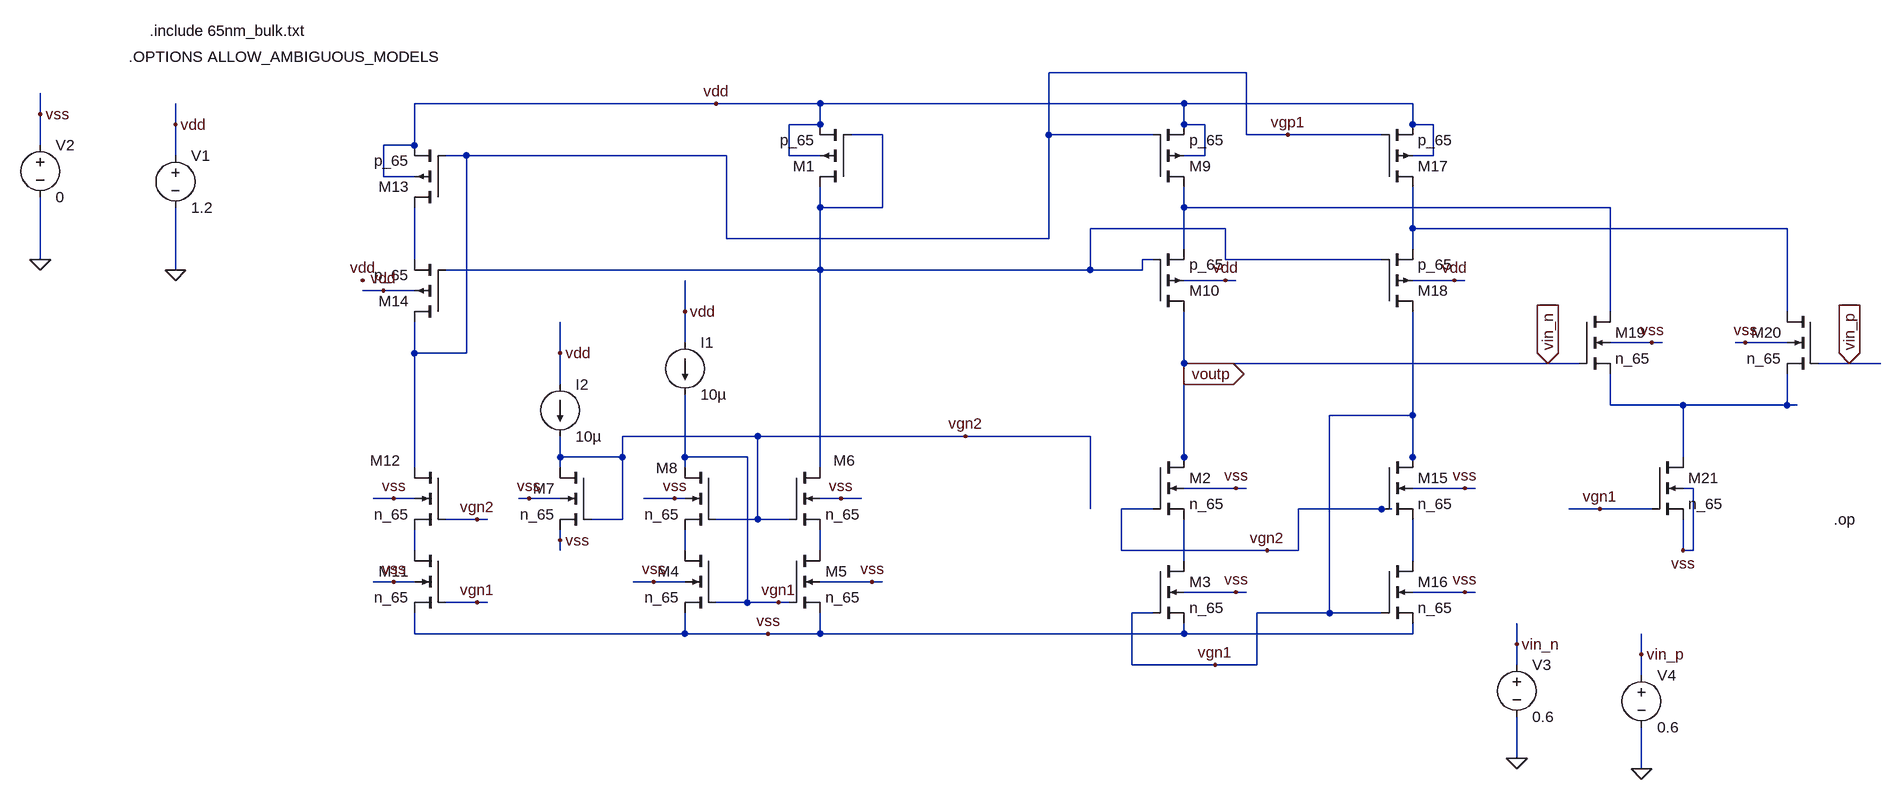
[diagram p0: schematic FC_SingleEnded_Test.asc]
FC_SingleEnded_Test.asc, the LTspice schematic file:
Version 4.1
SHEET 1 1996 680
WIRE 976 -480 672 -480
WIRE 160 -432 -304 -432
WIRE 320 -432 160 -432
WIRE 880 -432 320 -432
WIRE 1232 -432 880 -432
WIRE -880 -416 -880 -448
WIRE -672 -400 -672 -432
WIRE 320 -400 320 -432
WIRE 320 -400 272 -400
WIRE 880 -400 880 -432
WIRE 912 -400 880 -400
WIRE 1232 -400 1232 -432
WIRE 1264 -400 1232 -400
WIRE 416 -384 368 -384
WIRE 672 -384 672 -480
WIRE 832 -384 672 -384
WIRE 976 -384 976 -480
WIRE 1040 -384 976 -384
WIRE 1184 -384 1040 -384
WIRE -880 -368 -880 -416
WIRE -304 -368 -304 -432
WIRE -304 -368 -352 -368
WIRE -672 -352 -672 -400
WIRE -304 -352 -304 -368
WIRE -224 -352 -256 -352
WIRE 176 -352 -224 -352
WIRE 272 -352 272 -400
WIRE 320 -352 272 -352
WIRE 912 -352 912 -400
WIRE 912 -352 880 -352
WIRE 1264 -352 1264 -400
WIRE 1264 -352 1232 -352
WIRE -352 -320 -352 -368
WIRE -304 -320 -352 -320
WIRE 320 -272 320 -304
WIRE 416 -272 416 -384
WIRE 416 -272 320 -272
WIRE 880 -272 880 -304
WIRE 1536 -272 880 -272
WIRE 944 -240 736 -240
WIRE 1232 -240 1232 -304
WIRE 1808 -240 1232 -240
WIRE 176 -224 176 -352
WIRE 672 -224 672 -384
WIRE 672 -224 176 -224
WIRE 880 -208 880 -272
WIRE 1232 -208 1232 -240
WIRE -880 -192 -880 -288
WIRE -304 -192 -304 -272
WIRE 832 -192 816 -192
WIRE 944 -192 944 -240
WIRE 1184 -192 944 -192
WIRE -672 -176 -672 -272
WIRE 320 -176 320 -272
WIRE 320 -176 -256 -176
WIRE 736 -176 736 -240
WIRE 736 -176 320 -176
WIRE 816 -176 816 -192
WIRE 816 -176 736 -176
WIRE 944 -160 880 -160
WIRE 960 -160 944 -160
WIRE 1296 -160 1232 -160
WIRE 1312 -160 1296 -160
WIRE -352 -144 -384 -144
WIRE -304 -144 -352 -144
WIRE 112 -112 112 -160
WIRE 1536 -112 1536 -272
WIRE 1808 -112 1808 -240
WIRE 112 -64 112 -112
WIRE 1600 -64 1536 -64
WIRE 1616 -64 1600 -64
WIRE 1744 -64 1728 -64
WIRE 1808 -64 1744 -64
WIRE -304 -48 -304 -96
WIRE -224 -48 -224 -352
WIRE -224 -48 -304 -48
WIRE -80 -48 -80 -96
WIRE 880 -32 880 -112
WIRE 1440 -32 880 -32
WIRE 1488 -32 1440 -32
WIRE 1904 -32 1856 -32
WIRE 1952 -32 1904 -32
WIRE 880 -16 880 -32
WIRE -80 0 -80 -48
WIRE 1536 32 1536 -16
WIRE 1648 32 1536 32
WIRE 1808 32 1808 -16
WIRE 1808 32 1648 32
WIRE 1824 32 1808 32
WIRE 1232 48 1232 -112
WIRE 1232 48 1104 48
WIRE 224 80 16 80
WIRE 544 80 224 80
WIRE 736 80 544 80
WIRE -80 112 -80 80
WIRE 16 112 16 80
WIRE 16 112 -80 112
WIRE 112 112 112 16
WIRE 208 112 112 112
WIRE 880 112 880 -16
WIRE 1232 112 1232 48
WIRE 1648 112 1648 32
WIRE -304 128 -304 -48
WIRE -80 128 -80 112
WIRE 112 128 112 112
WIRE 320 128 320 -176
WIRE 880 128 880 112
WIRE 1232 128 1232 112
WIRE 960 160 880 160
WIRE 976 160 960 160
WIRE 1312 160 1232 160
WIRE 1328 160 1312 160
WIRE 1664 160 1648 160
WIRE -336 176 -368 176
WIRE -304 176 -336 176
WIRE -128 176 -144 176
WIRE -80 176 -128 176
WIRE 96 176 48 176
WIRE 112 176 96 176
WIRE 352 176 320 176
WIRE 384 176 352 176
WIRE 736 192 736 80
WIRE 832 192 784 192
WIRE 1184 192 1056 192
WIRE 1200 192 1184 192
WIRE 1520 192 1472 192
WIRE 1600 192 1520 192
WIRE -208 208 -256 208
WIRE -192 208 -208 208
WIRE 16 208 16 112
WIRE 16 208 -32 208
WIRE 224 208 224 80
WIRE 224 208 160 208
WIRE 272 208 224 208
WIRE -80 240 -80 224
WIRE -304 256 -304 224
WIRE -80 256 -80 240
WIRE 112 256 112 224
WIRE 320 256 320 224
WIRE 784 256 784 192
WIRE 1008 256 784 256
WIRE 1056 256 1056 192
WIRE 1056 256 1008 256
WIRE 1648 256 1648 208
WIRE 1664 256 1664 160
WIRE 1664 256 1648 256
WIRE 880 272 880 208
WIRE 1232 272 1232 208
WIRE -336 304 -368 304
WIRE -304 304 -336 304
WIRE 64 304 32 304
WIRE 112 304 64 304
WIRE 400 304 320 304
WIRE 416 304 400 304
WIRE 960 320 880 320
WIRE 976 320 960 320
WIRE 1312 320 1232 320
WIRE 1328 320 1312 320
WIRE -208 336 -256 336
WIRE -192 336 -208 336
WIRE 208 336 208 112
WIRE 208 336 160 336
WIRE 256 336 208 336
WIRE 272 336 256 336
WIRE 832 352 800 352
WIRE 1104 352 1104 48
WIRE 1104 352 992 352
WIRE 1184 352 1104 352
WIRE -304 384 -304 352
WIRE 112 384 112 352
WIRE 112 384 -304 384
WIRE 240 384 112 384
WIRE 320 384 320 352
WIRE 320 384 240 384
WIRE 880 384 880 368
WIRE 880 384 320 384
WIRE 1232 384 1232 368
WIRE 1232 384 880 384
WIRE 1392 400 1392 368
WIRE 1584 416 1584 384
WIRE 800 432 800 352
WIRE 928 432 800 432
WIRE 992 432 992 352
WIRE 992 432 928 432
WIRE 1392 432 1392 400
WIRE 1584 448 1584 416
WIRE 1392 576 1392 512
WIRE 1584 592 1584 528
FLAG 112 -112 vdd
FLAG 960 160 vss
FLAG 960 320 vss
FLAG 352 176 vss
FLAG 240 384 vss
FLAG -80 -48 vdd
FLAG -80 240 vss
FLAG 96 176 vss
FLAG 944 -160 vdd
FLAG -336 176 vss
FLAG -208 336 vgn1
FLAG -208 208 vgn2
FLAG 160 -432 vdd
FLAG -672 -176 0
FLAG -672 -400 vdd
FLAG -880 -192 0
FLAG -880 -416 vss
FLAG 880 -16 voutp
IOPIN 880 -16 Out
FLAG 1312 160 vss
FLAG 1312 320 vss
FLAG 1296 -160 vdd
FLAG 1600 -64 vss
FLAG 1744 -64 vss
FLAG 1648 256 vss
FLAG 1904 -32 vin_p
IOPIN 1904 -32 In
FLAG 1440 -32 vin_n
IOPIN 1440 -32 In
FLAG 1040 -384 vgp1
FLAG 544 80 vgn2
FLAG 928 432 vgn1
FLAG 1008 256 vgn2
FLAG 256 336 vgn1
FLAG -384 -160 vdd
FLAG -352 -144 vdd
FLAG 400 304 vss
FLAG 64 304 vss
FLAG -128 176 vss
FLAG -336 304 vss
FLAG 1392 576 0
FLAG 1392 400 vin_n
FLAG 1584 592 0
FLAG 1584 416 vin_p
FLAG 1520 192 vgn1
DATAFLAG 656 80 ""
DATAFLAG 736 -176 ""
DATAFLAG 992 -400 ""
DATAFLAG 1232 -416 ""
DATAFLAG 880 -64 ""
DATAFLAG 1232 -64 ""
DATAFLAG 1648 -240 ""
DATAFLAG 960 -272 ""
DATAFLAG 1232 256 ""
DATAFLAG 880 256 ""
DATAFLAG 1648 240 ""
DATAFLAG 848 352 ""
DATAFLAG 1088 -192 ""
DATAFLAG 1072 336 ""
DATAFLAG -240 208 ""
DATAFLAG -240 336 ""
DATAFLAG 176 208 ""
DATAFLAG 176 336 ""
DATAFLAG 64 -352 ""
DATAFLAG 16 -176 ""
DATAFLAG -304 -256 ""
DATAFLAG 1536 -224 ""
DATAFLAG 1648 80 ""
DATAFLAG 1520 176 ""
DATAFLAG 1232 -64 ""
DATAFLAG 880 48 ""
DATAFLAG 1888 -32 ""
DATAFLAG 1504 176 ""
SYMBOL pmos4 368 -304 R180
SYMATTR InstName M1
SYMATTR Value p_65
SYMATTR Value2 l=200n w=2.5u
SYMBOL nmos4 832 112 R0
SYMATTR InstName M2
SYMATTR Value n_65
SYMATTR Value2 l=200n w=10u
SYMBOL nmos4 832 272 R0
SYMATTR InstName M3
SYMATTR Value n_65
SYMATTR Value2 l=200n w=10u
SYMBOL nmos4 160 256 M0
SYMATTR InstName M4
SYMATTR Value n_65
SYMATTR Value2 l=200n w=10u
SYMBOL current 112 -64 R0
WINDOW 123 0 0 Left 0
WINDOW 39 0 0 Left 0
SYMATTR InstName I1
SYMATTR Value 10µ
SYMBOL nmos4 272 256 R0
SYMATTR InstName M5
SYMATTR Value n_65
SYMATTR Value2 l=200n w=10u
SYMBOL nmos4 272 128 R0
WINDOW 0 69 -11 Left 2
SYMATTR InstName M6
SYMATTR Value n_65
SYMATTR Value2 l=200n w=10u
SYMBOL nmos4 -32 128 M0
SYMATTR InstName M7
SYMATTR Value n_65
SYMATTR Value2 l=200n w=2.5u
SYMBOL current -80 0 R0
WINDOW 123 0 0 Left 0
WINDOW 39 0 0 Left 0
SYMATTR InstName I2
SYMATTR Value 10µ
SYMBOL nmos4 160 128 M0
WINDOW 0 59 1 Left 2
SYMATTR InstName M8
SYMATTR Value n_65
SYMATTR Value2 l=200n w=10u
SYMBOL pmos4 832 -304 M180
SYMATTR InstName M9
SYMATTR Value p_65
SYMATTR Value2 l=200n w=20u
SYMBOL pmos4 832 -112 M180
SYMATTR InstName M10
SYMATTR Value p_65
SYMATTR Value2 l=200n w=10u
SYMBOL nmos4 -256 256 M0
SYMATTR InstName M11
SYMATTR Value n_65
SYMATTR Value2 l=200n w=10u
SYMBOL nmos4 -256 128 M0
WINDOW 0 69 -11 Left 2
SYMATTR InstName M12
SYMATTR Value n_65
SYMATTR Value2 l=200n w=10u
SYMBOL pmos4 -256 -272 R180
SYMATTR InstName M13
SYMATTR Value p_65
SYMATTR Value2 l=200n w=10u
SYMBOL pmos4 -256 -96 R180
SYMATTR InstName M14
SYMATTR Value p_65
SYMATTR Value2 l=200n w=10u
SYMBOL voltage -672 -368 R0
WINDOW 123 0 0 Left 0
WINDOW 39 0 0 Left 0
SYMATTR InstName V1
SYMATTR Value 1.2
SYMBOL voltage -880 -384 R0
WINDOW 123 0 0 Left 0
WINDOW 39 0 0 Left 0
SYMATTR InstName V2
SYMATTR Value 0
SYMBOL nmos4 1184 112 R0
SYMATTR InstName M15
SYMATTR Value n_65
SYMATTR Value2 l=200n w=10u
SYMBOL nmos4 1184 272 R0
SYMATTR InstName M16
SYMATTR Value n_65
SYMATTR Value2 l=200n w=10u
SYMBOL pmos4 1184 -304 M180
SYMATTR InstName M17
SYMATTR Value p_65
SYMATTR Value2 l=200n w=20u
SYMBOL pmos4 1184 -112 M180
SYMATTR InstName M18
SYMATTR Value p_65
SYMATTR Value2 l=200n w=10u
SYMBOL nmos4 1488 -112 R0
SYMATTR InstName M19
SYMATTR Value n_65
SYMATTR Value2 l=200n w=80u
SYMBOL nmos4 1856 -112 M0
SYMATTR InstName M20
SYMATTR Value n_65
SYMATTR Value2 l=200n w=80u
SYMBOL nmos4 1600 112 R0
SYMATTR InstName M21
SYMATTR Value n_65
SYMATTR Value2 l=200n w=20u
SYMBOL voltage 1392 416 R0
WINDOW 123 0 0 Left 0
WINDOW 39 0 0 Left 0
SYMATTR InstName V3
SYMATTR Value 0.6
SYMBOL voltage 1584 432 R0
WINDOW 123 0 0 Left 0
WINDOW 39 0 0 Left 0
SYMATTR InstName V4
SYMATTR Value 0.6
TEXT -712 -544 Left 2 !.include 65nm_bulk.txt
TEXT -744 -504 Left 2 !.OPTIONS ALLOW_AMBIGUOUS_MODELS
TEXT 1880 208 Left 2 !.op

The netlist it stands for:
* FC_SingleEnded_Test.asc
M1 N001 N001 vdd vdd p_65 l=200n w=2.5u
M2 vin_n vgn2 N009 vss n_65 l=200n w=10u
M3 N009 vgn1 vss vss n_65 l=200n w=10u
M4 N007 vgn1 vss vss n_65 l=200n w=10u
I1 vdd vgn1 10µ
M5 N008 vgn1 vss vss n_65 l=200n w=10u
M6 N001 vgn2 N008 vss n_65 l=200n w=10u
M7 vgn2 vgn2 vss vss n_65 l=200n w=2.5u
I2 vdd vgn2 10µ
M8 vgn1 vgn2 N007 vss n_65 l=200n w=10u
M9 N002 vgp1 vdd vdd p_65 l=200n w=20u
M10 vin_n N001 N002 vdd p_65 l=200n w=10u
M11 N006 vgn1 vss vss n_65 l=200n w=10u
M12 vgp1 vgn2 N006 vss n_65 l=200n w=10u
M13 N004 vgp1 vdd vdd p_65 l=200n w=10u
M14 vgp1 N001 N004 vdd p_65 l=200n w=10u
V1 vdd 0 1.2
V2 vss 0 0
M15 vgn1 vgn2 N010 vss n_65 l=200n w=10u
M16 N010 vgn1 vss vss n_65 l=200n w=10u
M17 N003 vgp1 vdd vdd p_65 l=200n w=20u
M18 vgn1 N001 N003 vdd p_65 l=200n w=10u
M19 N002 vin_n N005 vss n_65 l=200n w=80u
M20 N003 vin_p N005 vss n_65 l=200n w=80u
M21 N005 vgn1 vss vss n_65 l=200n w=20u
V3 vin_n 0 0.6
V4 vin_p 0 0.6
.model NMOS NMOS
.model PMOS PMOS
.lib standard.mos
.include 65nm_bulk.txt
.OPTIONS ALLOW_AMBIGUOUS_MODELS
.op
.backanno
.end